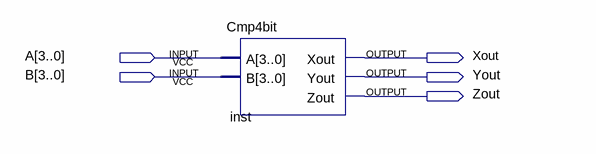
[diagram p0: schematic sheet]
// Quartus schematic CmpDemo.bdf as structural Verilog: 1 symbols, 5 pins
module CmpDemo (
  input  [3:0] A,
  input  [3:0] B,
  output Xout,
  output Yout,
  output Zout
);

  Cmp4bit inst (.A(A), .B(B), .Xout(Xout), .Yout(Yout), .Zout(Zout));
endmodule
